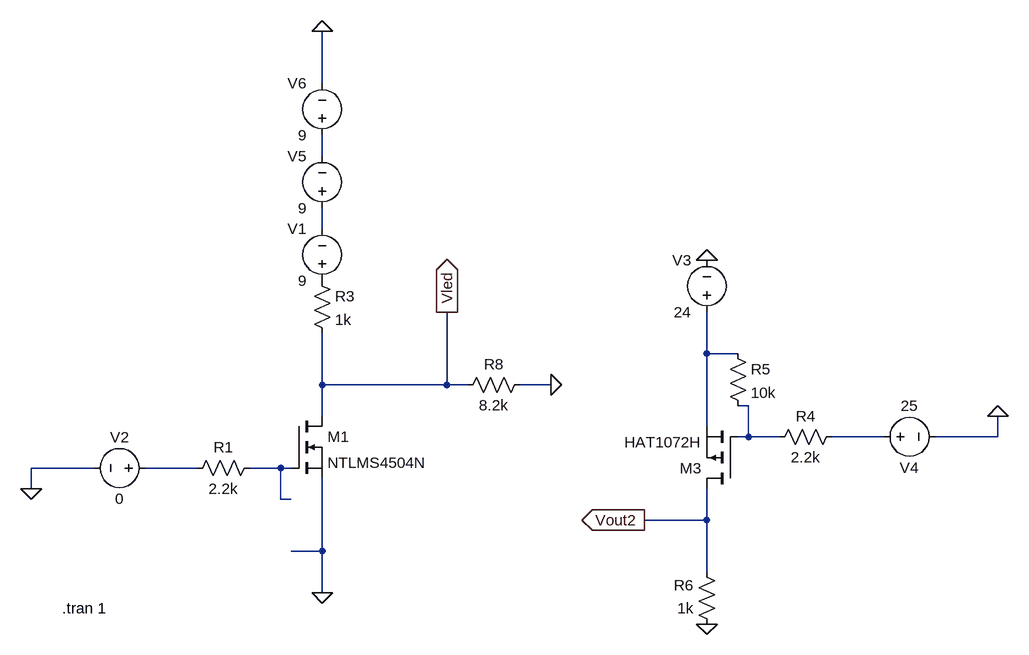
[diagram p0: schematic MOSFET Schematic.asc]
MOSFET Schematic.asc, the LTspice schematic file:
Version 4
SHEET 1 1472 680
WIRE 304 -448 304 -528
WIRE 304 -336 304 -368
WIRE 304 -224 304 -256
WIRE 896 -32 896 -96
WIRE 944 -32 896 -32
WIRE 304 16 304 -64
WIRE 496 16 496 -96
WIRE 496 16 304 16
WIRE 528 16 496 16
WIRE 656 16 608 16
WIRE 960 48 944 48
WIRE 304 64 304 16
WIRE 896 80 896 -32
WIRE 960 96 960 48
WIRE 960 96 944 96
WIRE 1008 96 960 96
WIRE 1168 96 1088 96
WIRE 1344 96 1344 64
WIRE 1344 96 1248 96
WIRE -48 144 -144 144
WIRE 112 144 32 144
WIRE 240 144 192 144
WIRE 256 144 240 144
WIRE -144 176 -144 144
WIRE 240 192 240 144
WIRE 256 192 240 192
WIRE 896 224 896 176
WIRE 896 224 800 224
WIRE 304 272 304 160
WIRE 304 272 256 272
WIRE 896 304 896 224
WIRE 304 336 304 272
FLAG -144 176 0
FLAG 896 384 0
FLAG 896 -176 0
FLAG 800 224 Vout2
IOPIN 800 224 Out
FLAG 1344 64 0
FLAG 496 -96 Vled
IOPIN 496 -96 Out
FLAG 304 -528 0
FLAG 304 336 0
FLAG 656 16 0
SYMBOL nmos 256 64 R0
SYMATTR InstName M1
SYMATTR Value NTLMS4504N
SYMBOL res 208 128 R90
WINDOW 0 0 56 VBottom 2
WINDOW 3 32 56 VTop 2
SYMATTR InstName R1
SYMATTR Value 2.2k
SYMBOL voltage 304 -128 R180
WINDOW 0 24 96 Left 2
WINDOW 3 24 16 Left 2
WINDOW 123 0 0 Left 0
WINDOW 39 0 0 Left 0
SYMATTR InstName V1
SYMATTR Value 9
SYMBOL voltage 48 144 R90
WINDOW 0 -32 56 VBottom 2
WINDOW 3 32 56 VTop 2
WINDOW 123 0 0 Left 0
WINDOW 39 0 0 Left 0
SYMATTR InstName V2
SYMATTR Value 0
SYMBOL res 288 -160 R0
SYMATTR InstName R3
SYMATTR Value 1k
SYMBOL res 992 112 R270
WINDOW 0 32 56 VTop 2
WINDOW 3 0 56 VBottom 2
SYMATTR InstName R4
SYMATTR Value 2.2k
SYMBOL res 928 -48 R0
SYMATTR InstName R5
SYMATTR Value 10k
SYMBOL voltage 896 -80 R180
WINDOW 0 24 96 Left 2
WINDOW 3 24 16 Left 2
WINDOW 123 0 0 Left 0
WINDOW 39 0 0 Left 0
SYMATTR InstName V3
SYMATTR Value 24
SYMBOL voltage 1152 96 R270
WINDOW 0 -32 56 VBottom 2
WINDOW 3 32 56 VTop 2
WINDOW 123 0 0 Left 0
WINDOW 39 0 0 Left 0
SYMATTR InstName V4
SYMATTR Value 25
SYMBOL res 912 400 R180
WINDOW 0 36 76 Left 2
WINDOW 3 36 40 Left 2
SYMATTR InstName R6
SYMATTR Value 1k
SYMBOL pmos 944 176 R180
SYMATTR InstName M3
SYMATTR Value HAT1072H
SYMBOL voltage 304 -240 R180
WINDOW 0 24 96 Left 2
WINDOW 3 24 16 Left 2
WINDOW 123 0 0 Left 0
WINDOW 39 0 0 Left 0
SYMATTR InstName V5
SYMATTR Value 9
SYMBOL voltage 304 -352 R180
WINDOW 0 24 96 Left 2
WINDOW 3 24 16 Left 2
WINDOW 123 0 0 Left 0
WINDOW 39 0 0 Left 0
SYMATTR InstName V6
SYMATTR Value 9
SYMBOL res 624 0 R90
WINDOW 0 0 56 VBottom 2
WINDOW 3 32 56 VTop 2
SYMATTR InstName R8
SYMATTR Value 8.2k
TEXT -96 360 Left 2 !.tran 1

The netlist it stands for:
* MOSFET Schematic.asc
M1 Vled N007 0 0 NTLMS4504N
R1 N007 N006 2.2k
V1 P001 N002 9
V2 N006 0 0
R3 P001 Vled 1k
R4 N004 N005 2.2k
R5 N003 N004 10k
V3 N003 0 24
V4 N005 0 25
R6 0 Vout2 1k
M3 Vout2 N004 N003 N003 HAT1072H
V5 N002 N001 9
V6 N001 0 9
R8 0 Vled 8.2k
.model NMOS NMOS
.model PMOS PMOS
.lib standard.mos
.tran 1
.backanno
.end